# Altium schematic sheet beacon_pcb.SchDoc: GPS Beacon
size B; DrawnBy: Khaled Hassan; Engineer: Khaled Hassan; Organization: visAR - IPPD 2015; Address1: Drawn by:; Address2: Khaled Hassan; Revision: 1; SheetNumber: 1; SheetTotal: 1; ProjectName: GPS Beacon; ImagePath: .\visAR_Logo_Colored.png
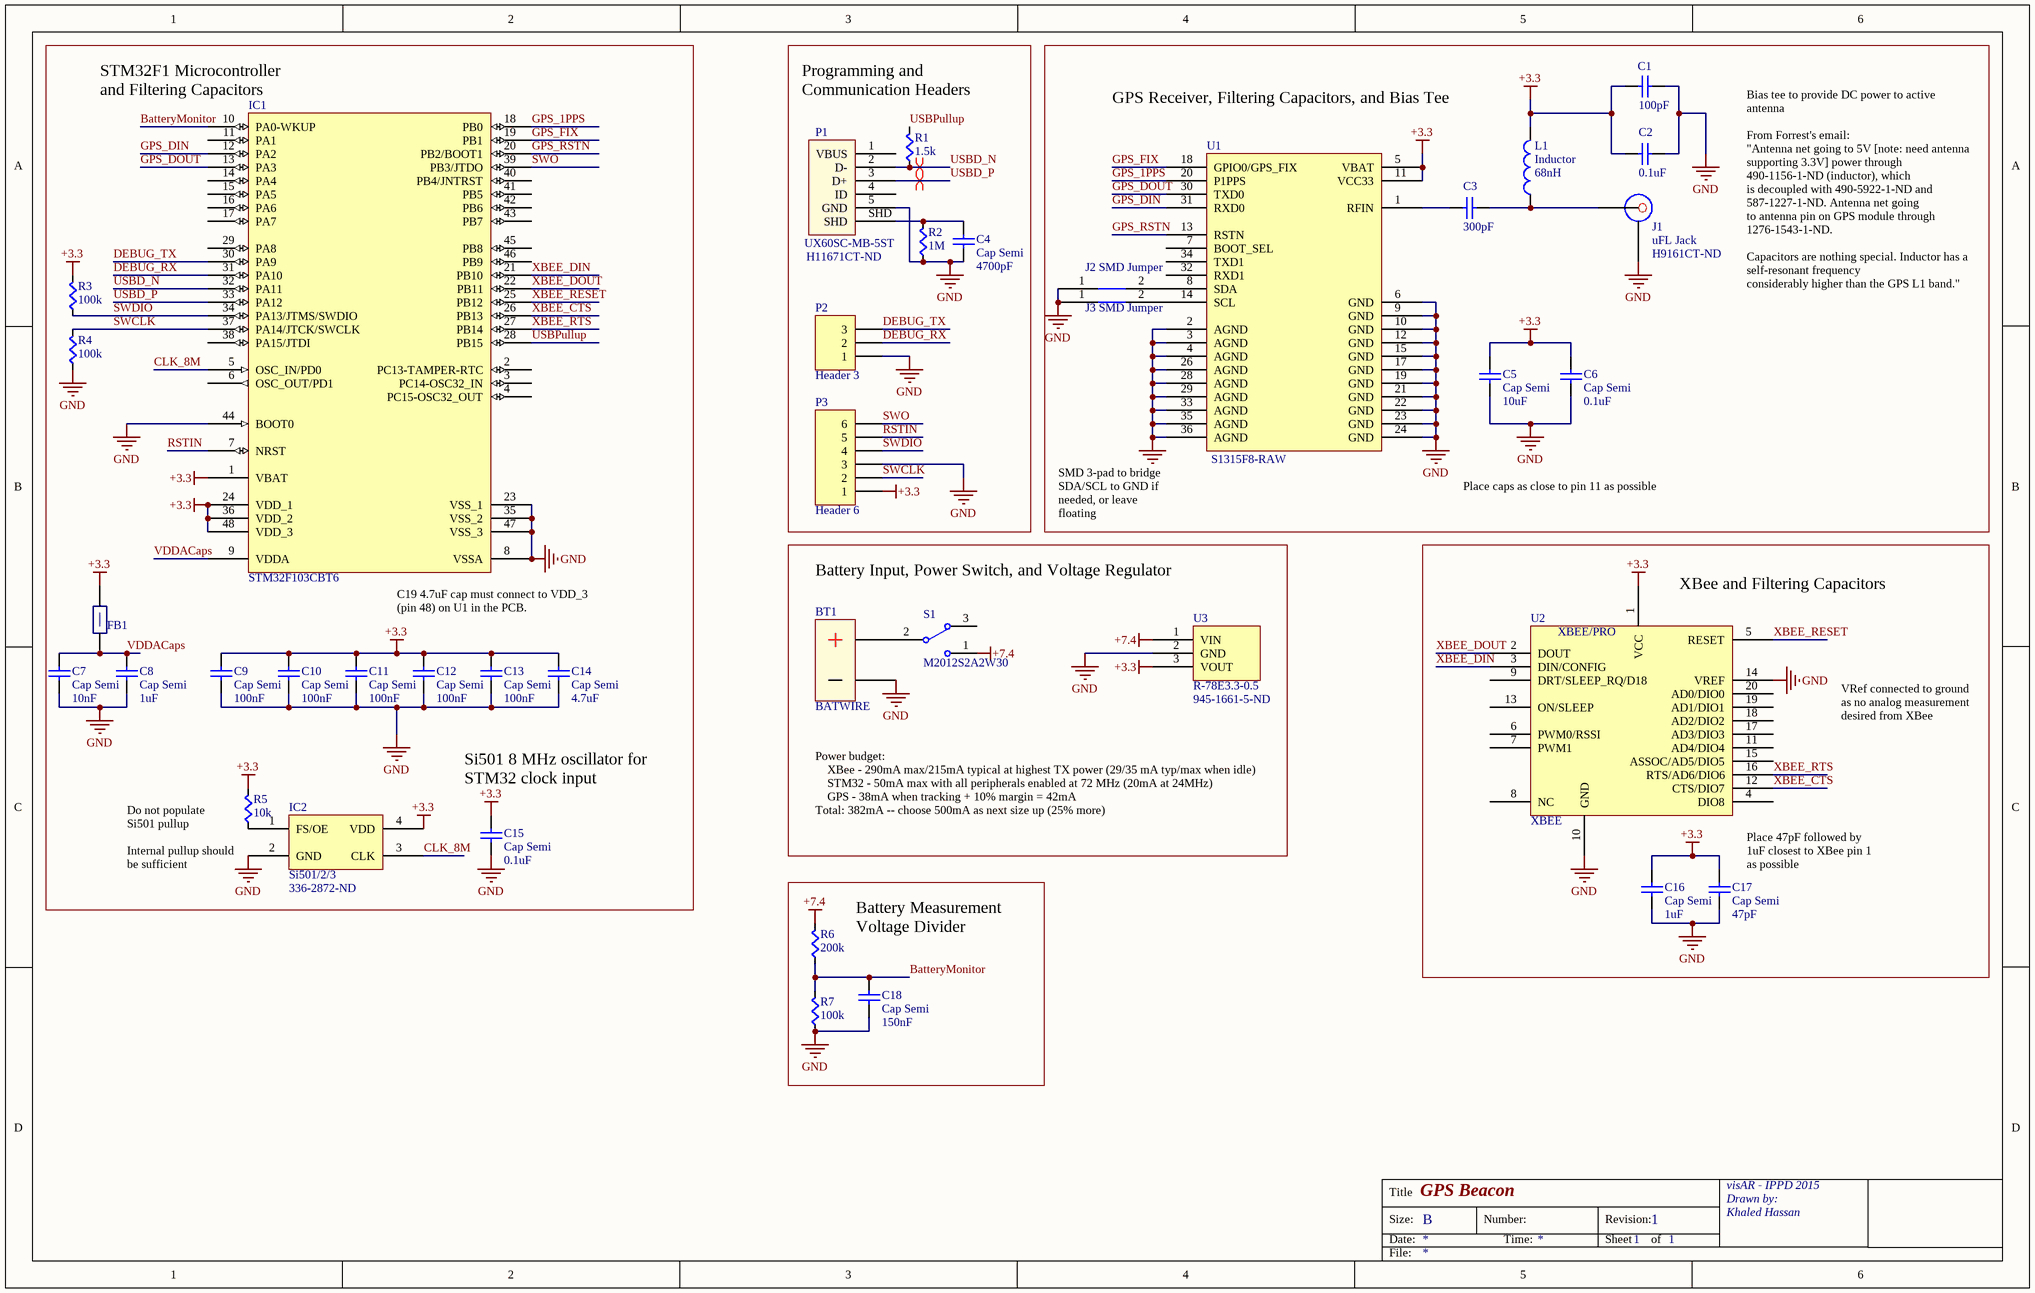
[diagram p0: beacon_pcb.SchDoc]

## Parts
BT1  BATWIRE  [BATWIRE12]
C1  value 100pF  [1608[0603]]  (hidden comment: Cap Semi)
C2  value 0.1uF  [1608[0603]]  (hidden comment: Cap Semi)
C3  value 300pF  [1608[0603]]  (hidden comment: Cap Semi)
C4  Cap Semi  value 4700pF  [1608[0603]]
C5  Cap Semi  value 10uF  [1608[0603]]
C6  Cap Semi  value 0.1uF  [1608[0603]]
C7  Cap Semi  value 10nF  [1608[0603]]
C8  Cap Semi  value 1uF  [1608[0603]]
C9  Cap Semi  value 100nF  [1608[0603]]
C10  Cap Semi  value 100nF  [1608[0603]]
C11  Cap Semi  value 100nF  [1608[0603]]
C12  Cap Semi  value 100nF  [1608[0603]]
C13  Cap Semi  value 100nF  [1608[0603]]
C14  Cap Semi  value 4.7uF  [1608[0603]]
C15  Cap Semi  value 0.1uF  [1608[0603]]
C16  Cap Semi  value 1uF  [1608[0603]]
C17  Cap Semi  value 47pF  [1608[0603]]
C18  Cap Semi  value 150nF  [1608[0603]]
FB1  FBead  [RES0603]  (value not drawn)
IC1  STM32F103CBT6  [STM-LQFP48_N]
IC2  Si501/2/3  Supplier Part Number 1: 336-2872-ND  [3.2 x 5 mm 4-pin DFN]
J1  uFL Jack  [H9161CT-ND]
J2  SMD Jumper  [SMD 2PAD]
J3  SMD Jumper  [SMD 2PAD]
L1  Inductor  value 68nH  [0402-A]
P1  UX60SC-MB-5ST  Supplier Part Number 1: H11671CT-ND  [UX60SC-MB-5ST]
P2  Header 3  [HDR1X3]
P3  Header 6  [HDR1X6]
R1  value 1.5k  [RES0603]  (hidden comment: Res)
R2  value 1M  [RES0603]  (hidden comment: Res)
R3  value 100k  [RES0603]  (hidden comment: Res)
R4  value 100k  [RES0603]  (hidden comment: Res)
R5  value 10k  [RES0603]  (hidden comment: Res)
R6  value 200k  [RES0603]  (hidden comment: Res)
R7  value 100k  [RES0603]  (hidden comment: Res)
S1  M2012S2A2W30  [M2012S2A2W30]
U1  S1315F8-RAW  [S1315F8-RAW]
U2  XBEE  [XBEE/PRO]
U3  R-78E3.3-0.5  Supplier Part Number 1: 945-1661-5-ND  [R-78E3.3-0.5]

## Nets
+3.3: C1.2 C2.2 C5.2 C6.2 C9.2 C10.2 C11.2 C12.2 C13.2 C14.2 C15.2 C16.2 C17.2 FB1.2(B) IC1.1(VBAT) IC1.24(VDD_1) IC1.36(VDD_2) IC1.48(VDD_3) IC2.4(VDD) L1.2 P3.1 R3.1(A) R5.1(A) U1.5(VBAT) U1.11(VCC33) U2.1(VCC) U3.3(VOUT)
+7.4: R6.1(A) S1.1 U3.1(VIN)
GND: BT1.- C1.1 C2.1 C4.1 C5.1 C6.1 C7.1 C8.1 C9.1 C10.1 C11.1 C12.1 C13.1 C14.1 C15.1 C16.1 C17.1 C18.1 IC1.8(VSSA) IC1.23(VSS_1) IC1.35(VSS_2) IC1.44(BOOT0) IC1.47(VSS_3) IC2.2(GND) J1.GND J2.1 J3.1 P1.5(GND) P2.1 P3.3 R2.2(B) R4.2(B) R7.2(B) U1.2(AGND) U1.3(AGND) U1.4(AGND) U1.6(GND) U1.9(GND) U1.10(GND) U1.12(GND) U1.15(GND) U1.17(GND) U1.19(GND) U1.21(GND) U1.22(GND) U1.23(GND) U1.24(GND) U1.26(AGND) U1.28(AGND) U1.29(AGND) U1.33(AGND) U1.35(AGND) U1.36(AGND) U2.10(GND) U2.14(VREF) U3.2(GND)
BatteryMonitor: C18.2 IC1.10(PA0-WKUP) R6.2(B) R7.1(A)
CLK_8M: IC1.5(OSC_IN/PD0) IC2.3(CLK)
DEBUG_RX: IC1.31(PA10) P2.2
DEBUG_TX: IC1.30(PA9) P2.3
GPS_1PPS: IC1.18(PB0) U1.20(P1PPS)
GPS_DIN: IC1.12(PA2) U1.31(RXD0)
GPS_DOUT: IC1.13(PA3) U1.30(TXD0)
GPS_FIX: IC1.19(PB1) U1.18(GPIO0/GPS_FIX)
GPS_RSTN: IC1.20(PB2/BOOT1) U1.13(RSTN)
RSTIN: IC1.7(NRST) P3.5
SWCLK: IC1.37(PA14/JTCK/SWCLK) P3.2 R4.1(A)
SWDIO: IC1.34(PA13/JTMS/SWDIO) P3.4 R3.2(B)
SWO: IC1.39(PB3/JTDO) P3.6
USBD_N: IC1.32(PA11) P1.2(D-) R1.2(B)
USBD_P: IC1.33(PA12) P1.3(D+)
USBPullup: IC1.28(PB15) R1.1(A)
VDDACaps: C7.2 C8.2 FB1.1(A) IC1.9(VDDA)
XBEE_CTS: IC1.26(PB13) U2.12(CTS/DIO7)
XBEE_DIN: IC1.21(PB10) U2.3(DIN/CONFIG)
XBEE_DOUT: IC1.22(PB11) U2.2(DOUT)
XBEE_RESET: IC1.25(PB12) U2.5(RESET)
XBEE_RTS: IC1.27(PB14) U2.16(RTS/AD6/DIO6)
NetBT1_+: BT1.+ S1.2
NetC3_1: C3.1 J1.SIG L1.1
NetC3_2: C3.2 U1.1(RFIN)
NetC4_2: C4.2 P1.SHD R2.1(A)
NetIC2_1: IC2.1(FS/OE) R5.2(B)
NetJ2_2: J2.2 U1.8(SDA)
NetJ3_2: J3.2 U1.14(SCL)

Not connected (* = marked no-connect by the designer): IC1 2(PC13-TAMPER-RTC) 3(PC14-OSC32_IN) 4(PC15-OSC32_OUT) 6(OSC_OUT/PD1) 11(PA1) 14(PA4) 15(PA5) 16(PA6) 17(PA7) 29(PA8) 38(PA15/JTDI) 40(PB4/JNTRST) 41(PB5) 42(PB6) 43(PB7) 45(PB8) 46(PB9); P1 1(VBUS) 4(ID); S1 3; U1 7(BOOT_SEL) 32(RXD1) 34(TXD1); U2 4(DIO8) 6(PWM0/RSSI) 7(PWM1) 8(NC) 9(DRT/SLEEP_RQ/D18) 11(AD4/DIO4) 13(ON/SLEEP) 15(ASSOC/AD5/DIO5) 17(AD3/DIO3) 18(AD2/DIO2) 19(AD1/DIO1) 20(AD0/DIO0)

## Layout directives
differential pair: USBD_N, USBD_P

## Notes on the sheet
- (near IC1) STM32F1 Microcontroller and Filtering Capacitors
- Programming and Communication Headers
- GPS Receiver, Filtering Capacitors, and Bias Tee
- Bias tee to provide DC power to active antenna
  From Forrest's email:
  "Antenna net going to 5V [note: need antenna supporting 3.3V] power through 490-1156-1-ND (inductor), which
  is decoupled with 490-5922-1-ND and 587-1227-1-ND. Antenna net going
  to antenna pin on GPS module through 1276-1543-1-ND.
  Capacitors are nothing special. Inductor has a self-resonant frequency
  considerably higher than the GPS L1 band."
- Place caps as close to pin 11 as possible
- (near U1) SMD 3-pad to bridge SDA/SCL to GND if needed, or leave floating
- (near IC1) C19 4.7uF cap must connect to VDD_3 (pin 48) on U1 in the PCB.
- Battery Input, Power Switch, and Voltage Regulator
- (near U2) XBee and Filtering Capacitors
- VRef connected to ground as no analog measurement desired from XBee
- (near C15) Si501 8 MHz oscillator for STM32 clock input
- (near R5) Do not populate Si501 pullup
  Internal pullup should be sufficient
- Power budget:
  XBee - 290mA max/215mA typical at highest TX power (29/35 mA typ/max when idle)
  STM32 - 50mA max with all peripherals enabled at 72 MHz (20mA at 24MHz)
  GPS - 38mA when tracking + 10% margin = 42mA
  Total: 382mA -- choose 500mA as next size up (25% more)
- Place 47pF followed by 1uF closest to XBee pin 1 as possible
- Battery Measurement Voltage Divider
- Title
- Size:
- Date:
- B
- Number:
- Time:
- Revision:
- Sheet
- of
- File:
- (in symbol XBEE) XBEE/PRO

## Library data of the parts
BT1 = BATWIRE: Two large gauge leads soldered directly to the board.
C1-C18 = Cap Semi: Capacitor (Semiconductor SIM Model); Published: 8-Jun-2000; LatestRevisionDate: 29-May-2009; LatestRevisionNote: IPC-7351 Footprint Added.; PackageReference: C1206; Publisher: Altium Limited; PackageDescription: Chip Capacitor
FB1 = FBead: Ferrite Bead; Supplier 1: Digi-Key; Supplier Part Number 1: 445-2988-1-ND
IC1 = STM32F103C8T6: STM32 ARM-based 32-bit MCU with 64 Kbytes Flash, 48-pin LQFP, Industrial Temperature; Published: 30-May-2008; DatasheetVersion: rev6, Mar-2008; PackageVersion: Mar-2008; PackageReference: LQFP48; Publisher: Altium Limited; PackageDescription: 48-Pin Low-Profile Quad Flat Pack, 7 x 7 mm Body, 0.5 mm Pitch (LQFP48); ComponentLink1Description: Manufacturer Link; ComponentLink1URL: www.st.com/stm32; ComponentLink2Description: Datasheet; ComponentLink2URL: http://www.st.com/stonline/products/literature/ds/13587.pdf
L1 = Inductor: Code_IEC: 1005; Published: 8-Jun-2000; LatestRevisionDate: 29-May-2009; LatestRevisionNote: IPC-7351 Footprint Added.; PackageReference: 0402-A; Publisher: Altium Limited; PackageDescription: Chip Inductor; Code_JEITA: 0402
P1 = UX60SC-MB-5ST: USB Mini B Metal Shield SMT; Supplier 1: Digi-Key
P2 = Header 3: Header, 3-Pin; LatestRevisionDate: 17-Jul-2002; LatestRevisionNote: Re-released for DXP Platform.; Publisher: Altium Limited
P3 = Header 6: Header, 6-Pin; LatestRevisionDate: 17-Jul-2002; LatestRevisionNote: Re-released for DXP Platform.; Publisher: Altium Limited
S1 = SW-SPDT: SPDT Subminiature Toggle Switch, Right Angle Mounting, Vertical Actuation; Published: 24-Mar-1999; LatestRevisionDate: 17-Dec-2003; LatestRevisionNote: Schematic revised, PCB Footprint replaced.; DatasheetVersion: 05-Dec-2000; PackageReference: TL36WW15050; Publisher: Altium Limited; PackageDescription: Switch; 4 Leads; ComponentLink1Description: Manufacturer Link; ComponentLink1URL: http://www.apem.com
IC2 = Si501/2/3: Supplier 1: Digi-Key
J1 = uFL Jack: Supplier 1: Digi-Key; Supplier Part Number 1: H9161CT-ND
R1-R7 = Res: Supplier 1: Digi-Key; Supplier Part Number 1: RMCF0603JT10K0CT-ND
U3 = R-78E3.3-0.5: Supplier 1: Digi-Key